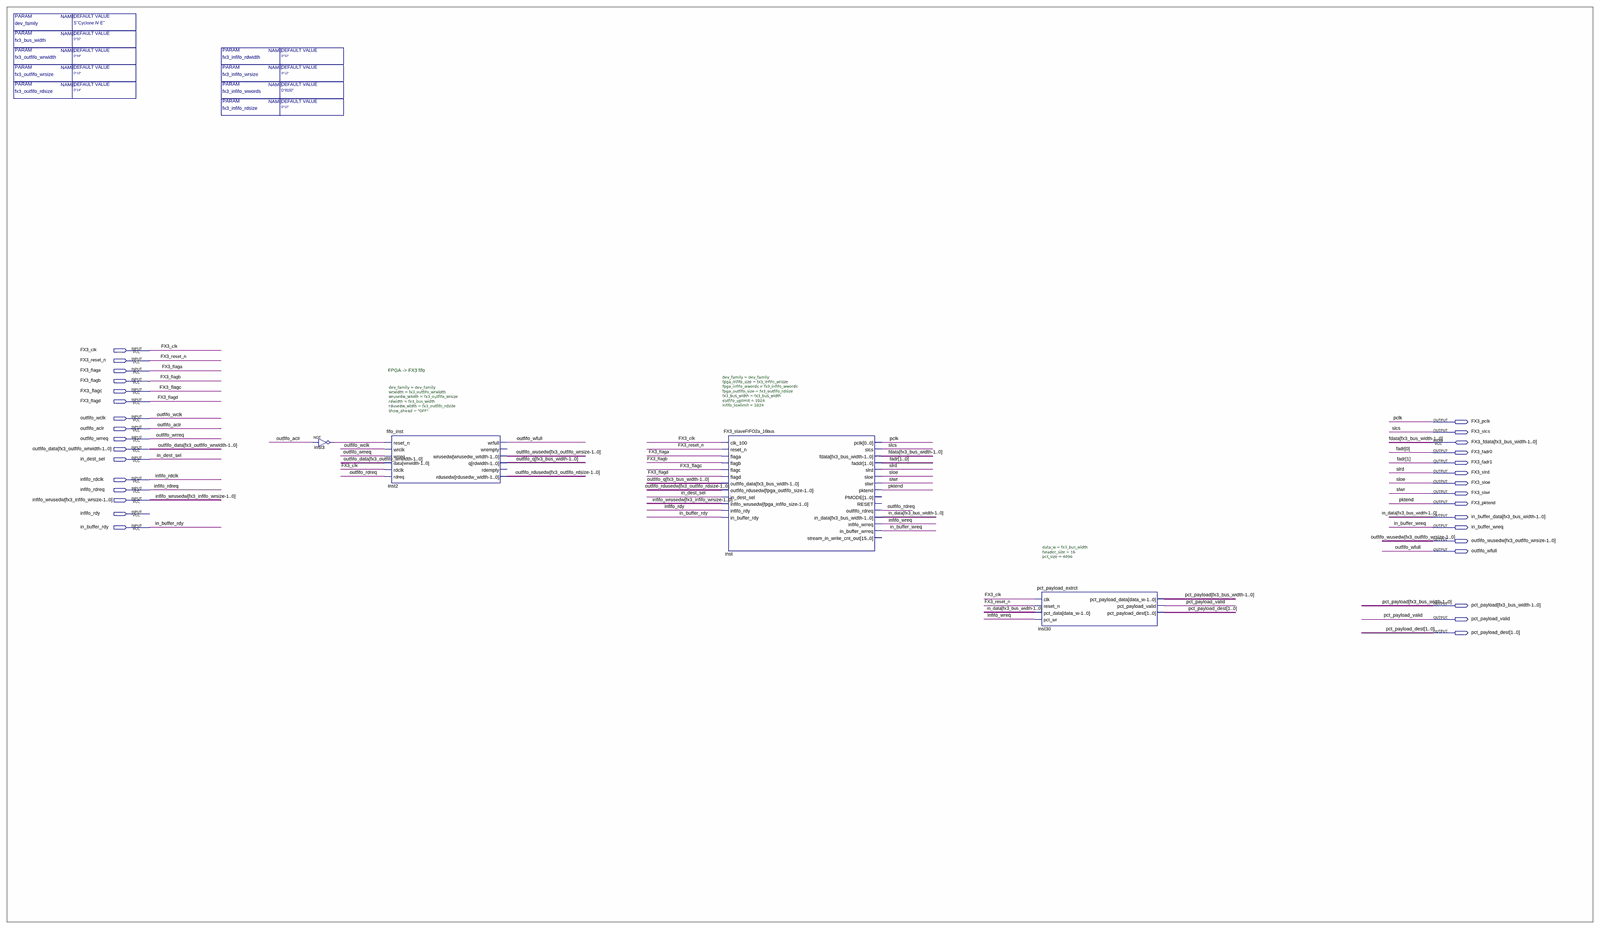
[diagram p0: schematic sheet, whole]
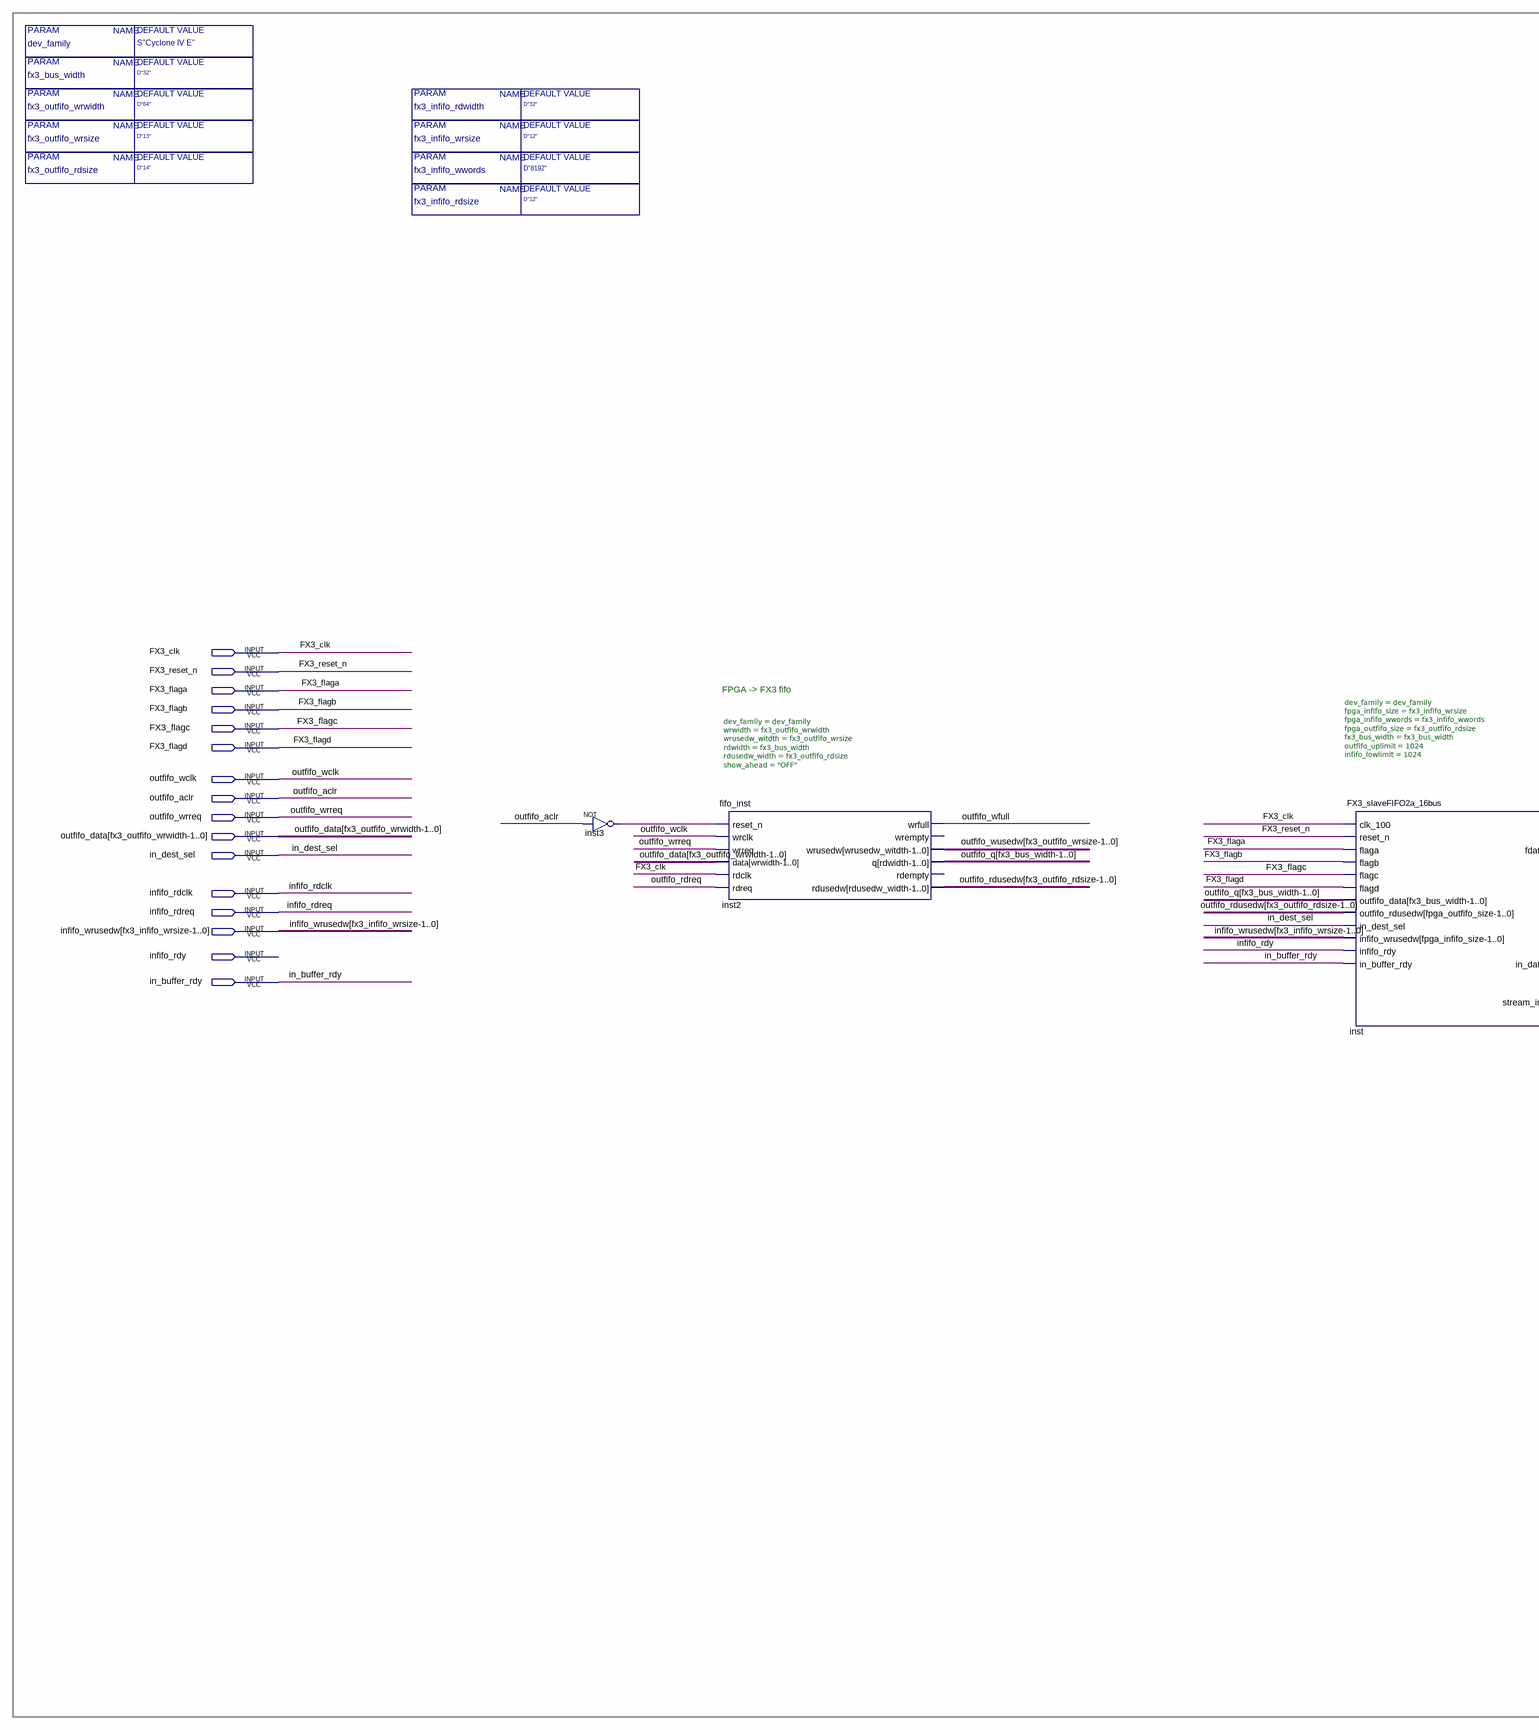
[diagram p1: schematic sheet, left part]
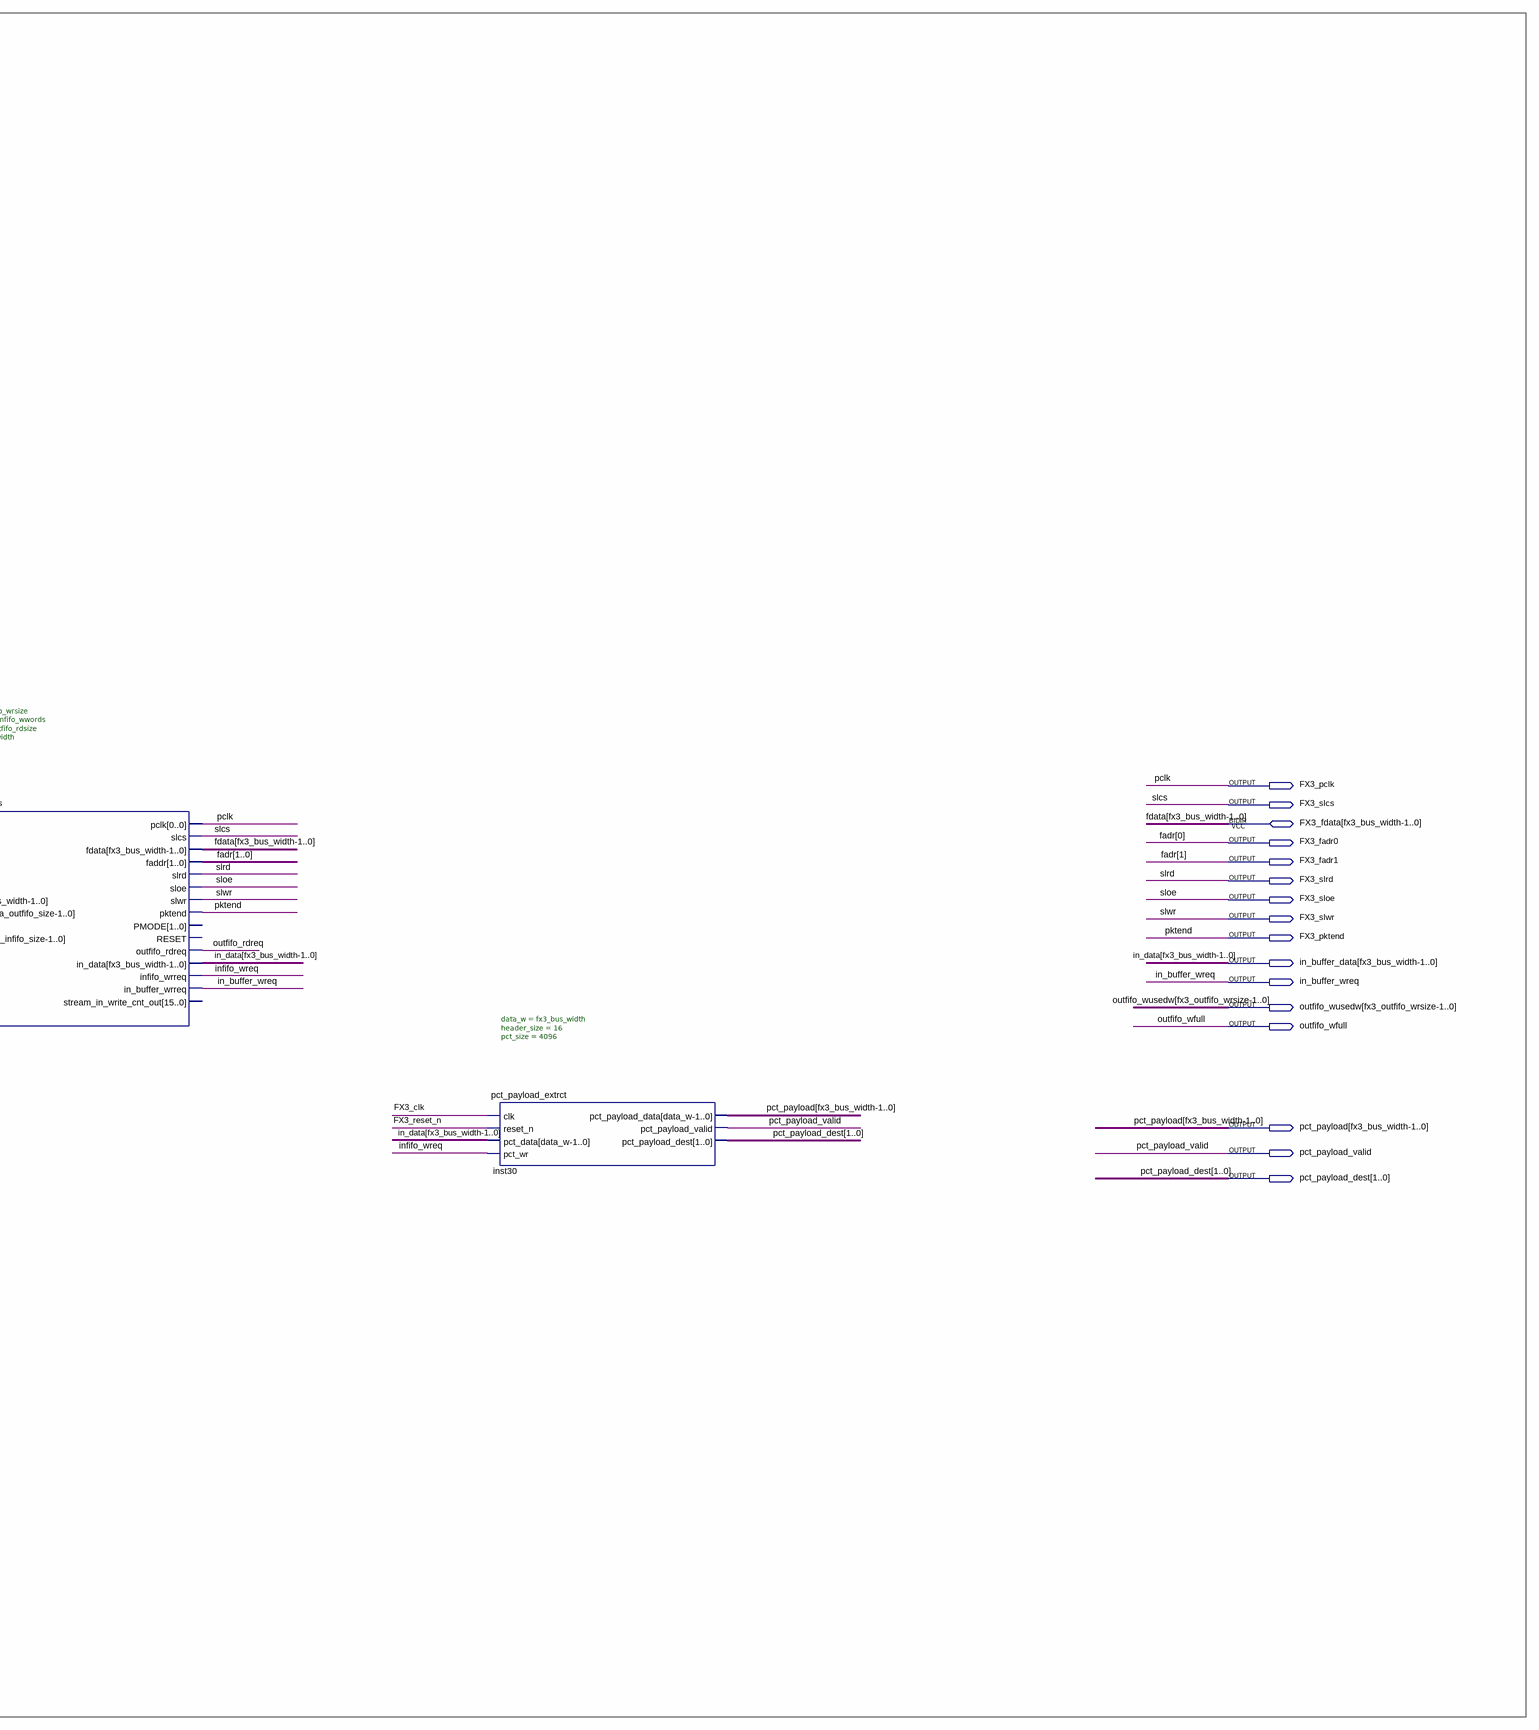
[diagram p2: schematic sheet, right part]
// Quartus schematic FX3_slave.bdf as structural Verilog: 4 symbols, 32 pins
module FX3_slave #(parameter fx3_bus_width = "D\"32\"", parameter dev_family = "S\"Cyclone IV E\"", parameter fx3_outfifo_wrwidth = "D\"64\"", parameter fx3_outfifo_wrsize = "D\"13\"", parameter fx3_outfifo_rdsize = "D\"14\"", parameter fx3_infifo_rdwidth = "D\"32\"", parameter fx3_infifo_wwords = "D\"8192\"", parameter fx3_infifo_wrsize = "D\"12\"", parameter fx3_infifo_rdsize = "D\"12\"") (
  input  FX3_clk,
  input  FX3_reset_n,
  input  FX3_flaga,
  input  FX3_flagb,
  input  FX3_flagc,
  input  FX3_flagd,
  input  outfifo_wclk,
  input  outfifo_aclr,
  input  outfifo_wrreq,
  input  \outfifo_data[fx3_outfifo_wrwidth-1..0] ,
  input  in_dest_sel,
  input  infifo_rdclk,
  input  infifo_rdreq,
  input  \infifo_wrusedw[fx3_infifo_wrsize-1..0] ,
  input  infifo_rdy,
  input  in_buffer_rdy,
  inout  \FX3_fdata[fx3_bus_width-1..0] ,
  output FX3_pclk,
  output FX3_slcs,
  output FX3_fadr0,
  output FX3_fadr1,
  output FX3_slrd,
  output FX3_sloe,
  output FX3_slwr,
  output FX3_pktend,
  output \in_buffer_data[fx3_bus_width-1..0] ,
  output in_buffer_wreq,
  output \outfifo_wusedw[fx3_outfifo_wrsize-1..0] ,
  output outfifo_wfull,
  output \pct_payload[fx3_bus_width-1..0] ,
  output pct_payload_valid,
  output [1:0] pct_payload_dest
);

  wire infifo_wreq, inst3_out, \outfifo_q[fx3_bus_width-1..0] , outfifo_rdreq,
       \outfifo_rdusedw[fx3_outfifo_rdsize-1..0] ;

  not inst3 (inst3_out, outfifo_aclr);
  fifo_inst #(.dev_family(dev_family), .wrwidth(fx3_outfifo_wrwidth), .wrusedw_witdth(fx3_outfifo_wrsize), .rdwidth(fx3_bus_width), .rdusedw_width(fx3_outfifo_rdsize), .show_ahead("OFF")) inst2 (
    .reset_n(inst3_out), .wrclk(outfifo_wclk), .wrreq(outfifo_wrreq),
    .data(\outfifo_data[fx3_outfifo_wrwidth-1..0] ), .rdclk(FX3_clk), .rdreq(outfifo_rdreq),
    .wrfull(outfifo_wfull), .wrusedw(\outfifo_wusedw[fx3_outfifo_wrsize-1..0] ),
    .q(\outfifo_q[fx3_bus_width-1..0] ), .rdusedw(\outfifo_rdusedw[fx3_outfifo_rdsize-1..0] ));  // open: wrempty, rdempty
  FX3_slaveFIFO2a_16bus #(.dev_family(dev_family), .fpga_infifo_size(fx3_infifo_wrsize), .fpga_infifo_wwords(fx3_infifo_wwords), .fpga_outfifo_size(fx3_outfifo_rdsize), .fx3_bus_width(fx3_bus_width), .outfifo_uplimit(1024), .infifo_lowlimit(1024)) inst (
    .clk_100(FX3_clk), .reset_n(FX3_reset_n), .flaga(FX3_flaga), .flagb(FX3_flagb), .flagc(FX3_flagc),
    .flagd(FX3_flagd), .outfifo_data(\outfifo_q[fx3_bus_width-1..0] ),
    .outfifo_rdusedw(\outfifo_rdusedw[fx3_outfifo_rdsize-1..0] ), .in_dest_sel(in_dest_sel),
    .infifo_wrusedw(\infifo_wrusedw[fx3_infifo_wrsize-1..0] ), .infifo_rdy(infifo_rdy),
    .in_buffer_rdy(in_buffer_rdy), .pclk(FX3_pclk), .slcs(FX3_slcs), .faddr({FX3_fadr1, FX3_fadr0}),
    .slrd(FX3_slrd), .sloe(FX3_sloe), .slwr(FX3_slwr), .pktend(FX3_pktend), .outfifo_rdreq(outfifo_rdreq),
    .in_data(\in_buffer_data[fx3_bus_width-1..0] ), .infifo_wrreq(infifo_wreq),
    .in_buffer_wrreq(in_buffer_wreq), .fdata(\FX3_fdata[fx3_bus_width-1..0] ));  // open: PMODE, RESET, stream_in_write_cnt_out
  pct_payload_extrct #(.data_w(fx3_bus_width), .header_size(16), .pct_size(4096)) inst30 (
    .clk(FX3_clk), .reset_n(FX3_reset_n), .pct_data(\in_buffer_data[fx3_bus_width-1..0] ),
    .pct_wr(infifo_wreq), .pct_payload_data(\pct_payload[fx3_bus_width-1..0] ),
    .pct_payload_valid(pct_payload_valid), .pct_payload_dest(pct_payload_dest));

  // Other names for the same wires on the sheet: fadr[1:0] = {FX3_fadr1, FX3_fadr0};
  //   fdata[fx3_bus_width-1..0] = \FX3_fdata[fx3_bus_width-1..0] ;
  //   in_data[fx3_bus_width-1..0] = \in_buffer_data[fx3_bus_width-1..0] ; pclk = FX3_pclk; pktend = FX3_pktend;
  //   slcs = FX3_slcs; sloe = FX3_sloe; slrd = FX3_slrd; slwr = FX3_slwr

  // Notes on the sheet:
  //   FPGA -> FX3 fifo
endmodule
